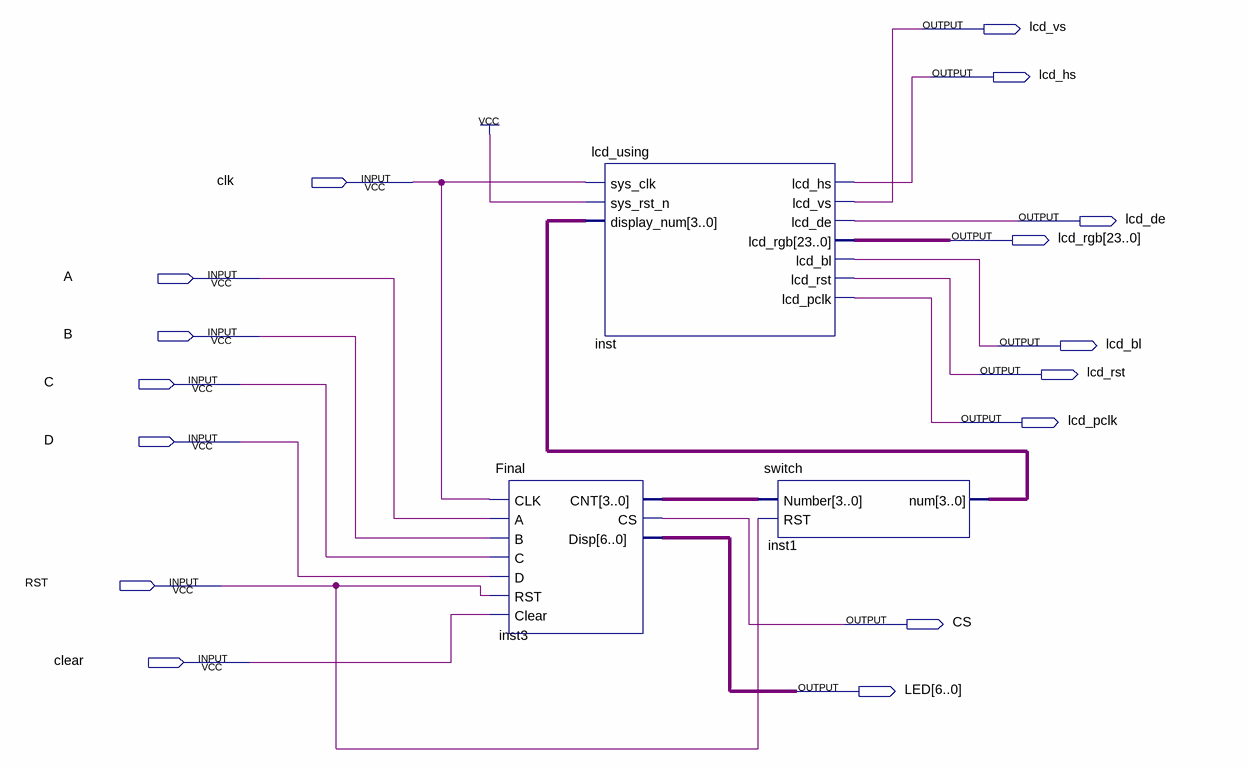
[diagram p0: schematic sheet]
// Quartus schematic VGA.bdf as structural Verilog: 3 symbols, 16 pins
module VGA (
  input  clk,
  input  A,
  input  B,
  input  C,
  input  D,
  input  RST,
  input  clear,
  output lcd_vs,
  output lcd_hs,
  output lcd_de,
  output [23:0] lcd_rgb,
  output lcd_bl,
  output lcd_rst,
  output lcd_pclk,
  output CS,
  output [6:0] LED
);

  wire [3:0] inst1_num, inst3_cnt;

  Final inst3 (.CLK(clk), .A(A), .B(B), .C(C), .D(D), .RST(RST), .Clear(clear), .CNT(inst3_cnt), .CS(CS), .Disp(LED));
  lcd_using inst (
    .sys_clk(clk), .sys_rst_n(1'b1), .display_num(inst1_num), .lcd_hs(lcd_hs), .lcd_vs(lcd_vs),
    .lcd_de(lcd_de), .lcd_rgb(lcd_rgb), .lcd_bl(lcd_bl), .lcd_rst(lcd_rst), .lcd_pclk(lcd_pclk));
  switch inst1 (.Number(inst3_cnt), .RST(RST), .num(inst1_num));
endmodule
